# EasyEDA Pro project ProDoc_P1_2026-04-12.epro

# Schematic Schematic1
Assembly Variant: Basic; Board Name: Board1; Create Date: 2026-04-01; Page Name: P1; Project Name: 基于单片机和AI声控的婴儿哭声检测器设计; Schematic Name: Schematic1; Update Date: 2026-04-01; BladeWidth: 10; Company: 嘉立创EDA; Page Size: A4; RegionStart: 1; ShowBorder: 1; TitleBlock: 1; TitleBlockPosition: 3; Version: V1.0; XRegionCount: 6; YRegionCount: 4
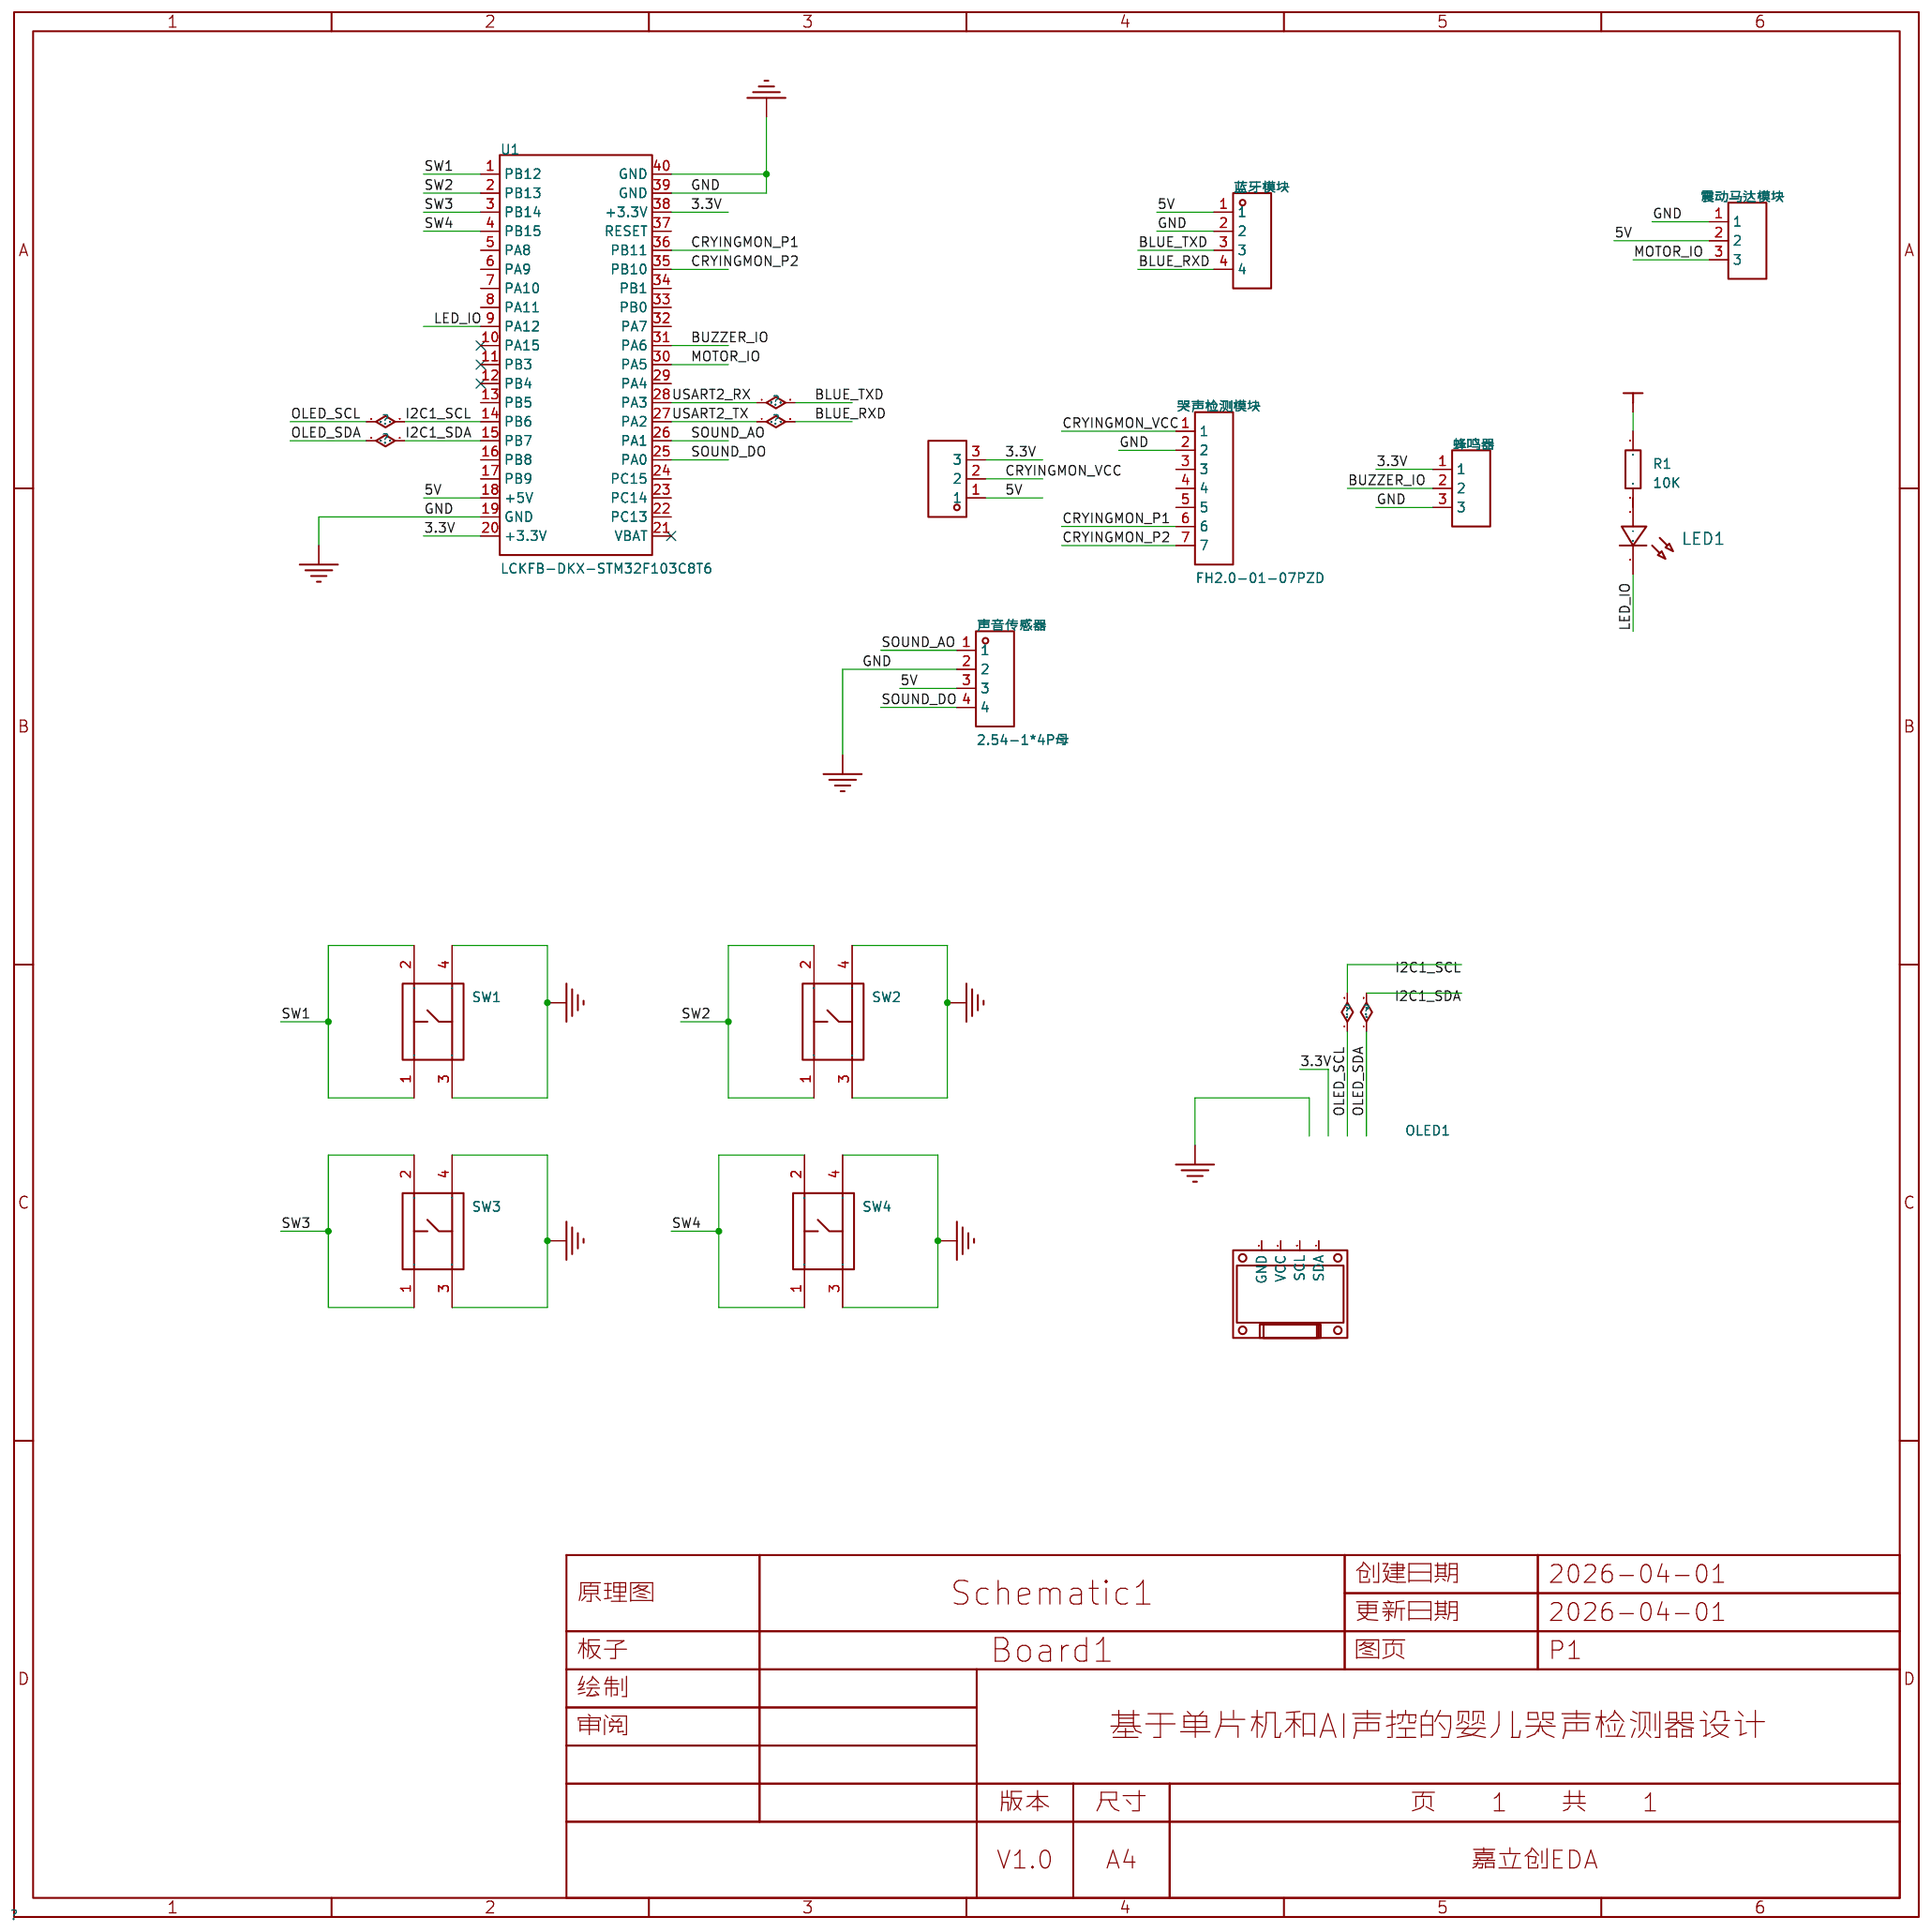
[diagram p0: schematic sheet]

## Parts
LED1  -  [LED_0805]
OLED1  -  [0.96OLED_4P]
R1  10K  [R0805]
SW1  K2-1102DP-C4SW-04  [KEY-TH_4P-L6.0-W6.0-P4.50-LS6.50]
SW2  K2-1102DP-C4SW-04  [KEY-TH_4P-L6.0-W6.0-P4.50-LS6.50]
SW3  K2-1102DP-C4SW-04  [KEY-TH_4P-L6.0-W6.0-P4.50-LS6.50]
SW4  K2-1102DP-C4SW-04  [KEY-TH_4P-L6.0-W6.0-P4.50-LS6.50]
U1  LCKFB-DKX-STM32F103C8T6  [CONN-TH_L53.3-W22.9_STM32F103C8T6-CARD]
哭声检测模块  FH2.0-01-07PZD  [HDR-TH_7P-P2.00-V-F]
声音传感器  2.54-1*4P母  [HDR-TH_4P-P2.54-V-F]
蓝牙模块  -  [HDR-TH_4P-P2.54-V-F]
蜂鸣器  -  [HDR-TH_3P-P2.54-V-F]
跳线1  -  [HDR-TH_3P-P2.54-V-M]
震动马达模块  -  [HDR-TH_3P-P2.54-V-F]

## Library data of the parts
LED1 = LED_0805-R: Supplier Footprint: 0805
OLED1 = 0.96OLED模块_4P: Supplier Footprint: 插件
R1 = Res_0805: Supplier Footprint: 0805
SW1-SW4 = K2-1102DP-C4SW-04: 电路结构:单刀单掷;按钮形状:圆形按钮;作用力:2.5N;安装方式:直插;开关长度:6mm;开关宽度:6mm;开关高度:5mm;触点电流:50mA;额定电压:12V;带灯:-;工作寿命:10万次;; LCSC Part Name: 轻触按键开关6*6*5; Supplier Part: C110153; Manufacturer: 韩国韩荣; Supplier Footprint: 插件-4P,6x6mm; JLCPCB Part Class: Extended Part; Datasheet: https://item.szlcsc.com/datasheet/K2-1102DP-C4SW-04/111374.html; Supplier: LCSC; Circuit: 单刀单掷; Actuator Style: 圆形按钮; Operating Force: 2.5N; Mounting Type: 直插; Length: 6mm; Width: 6mm; Switch Height: 5mm; Contact Current: 50mA; Voltage Rating: 12V; Life: 10万次; Operating Temperature: -25℃~+85℃
U1 = LCKFB-DKX-STM32F103C8T6: 搭载Contex M3内核,程序存储容量64KB,RAM总容量20KB,最高72MHz主频,提供高效的计算能力和稳定的运行环境。; LCSC Part Name: 立创·地阔星-STM32F103C8T6开发板; Supplier Part: C22396880; Manufacturer: 立创开发板; JLCPCB Part Class: Extended Part; Datasheet: https://item.szlcsc.com/datasheet/LCKFB-DKX-STM32F103C8T6/24005615.html; Supplier: LCSC
哭声检测模块 = FH2.0-01-07PZD: 插孔结构:1x7P;间距:2mm;圆孔/方孔:方孔;安装方式:直插;排数:单排;总孔位数:7P;额定电流:1.5A;插孔方向:顶部;塑高:4.3mm;触头材质:黄铜;触头镀层:金;工作温度:-40℃~+105℃;; LCSC Part Name: 1x7P 间距:2mm 直插; Supplier Part: C49286742; Manufacturer: XUNPU(讯普); Supplier Footprint: 插件,P=2mm; JLCPCB Part Class: Extended Part; Datasheet: https://item.szlcsc.com/datasheet/FH2.0-01-07PZD/51736527.html; Supplier: LCSC; Holes Structure: 1x7P; Pitch: 2mm; Circular Hole / Square Hole: 方孔; Mounting Type: 直插; Number of Rows: 单排; Number of Positions: 7P; Current Rating: 1.5A; Holes Direction: 顶部; Insulation Height: 4.3mm; Contact Material: 黄铜; Contact Plating: 金; Operating Temperature: -40℃~+105℃; PIN Length: 2.8mm
声音传感器 = 2.54-1*4P母: 插孔结构:1x4P;间距:2.54mm;行距:-;圆孔/方孔:方孔;安装方式:直插;排数:单排;总孔位数:4P;额定电流:3A;额定电压:-;插孔方向:顶部;塑高:-;触头材质:青铜;触头镀层:-;工作温度:-40℃~+105℃;; LCSC Part Name: 间距:2.54mm 1x4P 直插; Supplier Part: C2718488; Manufacturer: BOOMELE(博穆精密); Supplier Footprint: 插件,P=2.54mm; JLCPCB Part Class: Extended Part; Datasheet: https://item.szlcsc.com/datasheet/2.54-1*4P%25E6%25AF%258D/2834502.html; Supplier: LCSC; Holes Structure: 1x4P; Pitch: 2.54mm; Circular Hole / Square Hole: 方孔; Mounting Type: 直插; Number of Rows: 单排; Number of Positions: 4P; Current Rating: 3A; Holes Direction: 顶部; Contact Material: 青铜; Operating Temperature: -40℃~+105℃
蓝牙模块 = HDR-F_2.54_1x4P: Supplier Part: C2718488; Supplier Footprint: 插件
蜂鸣器 震动马达模块 = HDR-F_2.54_1x3P: Supplier Part: C541850; Supplier Footprint: 插件
跳线1 = HDR-M_2.54_1x3P: Supplier Part: C2937625; Supplier Footprint: 插件

## Nets
3.3V: R1.2 U1.20(+3.3V) U1.38(+3.3V) 蜂鸣器.1 跳线1.3
5V: U1.18(+5V) 声音传感器.3 蓝牙模块.1 跳线1.1 震动马达模块.2
GND: SW1.3 SW1.4 SW2.3 SW2.4 SW3.3 SW3.4 SW4.3 SW4.4 U1.19(GND) U1.39(GND) U1.40(GND) 哭声检测模块.2 声音传感器.2 蓝牙模块.2 蜂鸣器.3 震动马达模块.1
BLUE_RXD: U1.27(PA2) 蓝牙模块.4
BLUE_TXD: U1.28(PA3) 蓝牙模块.3
BUZZER_IO: U1.31(PA6) 蜂鸣器.2
CRYINGMON_P1: U1.36(PB11) 哭声检测模块.6
CRYINGMON_P2: U1.35(PB10) 哭声检测模块.7
CRYINGMON_VCC: 哭声检测模块.1 跳线1.2
I2C1_SCL: U1.14(PB6)
I2C1_SDA: U1.15(PB7)
LED_IO: LED1.1(C) U1.9(PA12)
MOTOR_IO: U1.30(PA5) 震动马达模块.3
SOUND_AO: U1.26(PA1) 声音传感器.1
SOUND_DO: U1.25(PA0) 声音传感器.4
SW1: SW1.1 SW1.2 U1.1(PB12)
SW2: SW2.1 SW2.2 U1.2(PB13)
SW3: SW3.1 SW3.2 U1.3(PB14)
SW4: SW4.1 SW4.2 U1.4(PB15)
Net-(LED1-2): LED1.2(A) R1.1

Not connected (* = marked no-connect by the designer): OLED1 1(GND) 2(VCC) 3(SCL) 4(SDA); U1 5(PA8) 6(PA9) 7(PA10) 8(PA11) 10(PA15)* 11(PB3)* 12(PB4)* 13(PB5) 16(PB8) 17(PB9) 21(VBAT)* 22(PC13) 23(PC14) 24(PC15) 29(PA4) 32(PA7) 33(PB0) 34(PB1) 37(RESET); 哭声检测模块 3 4 5
